# EAGLE design 02-ui (EAGLE 9.6.2)
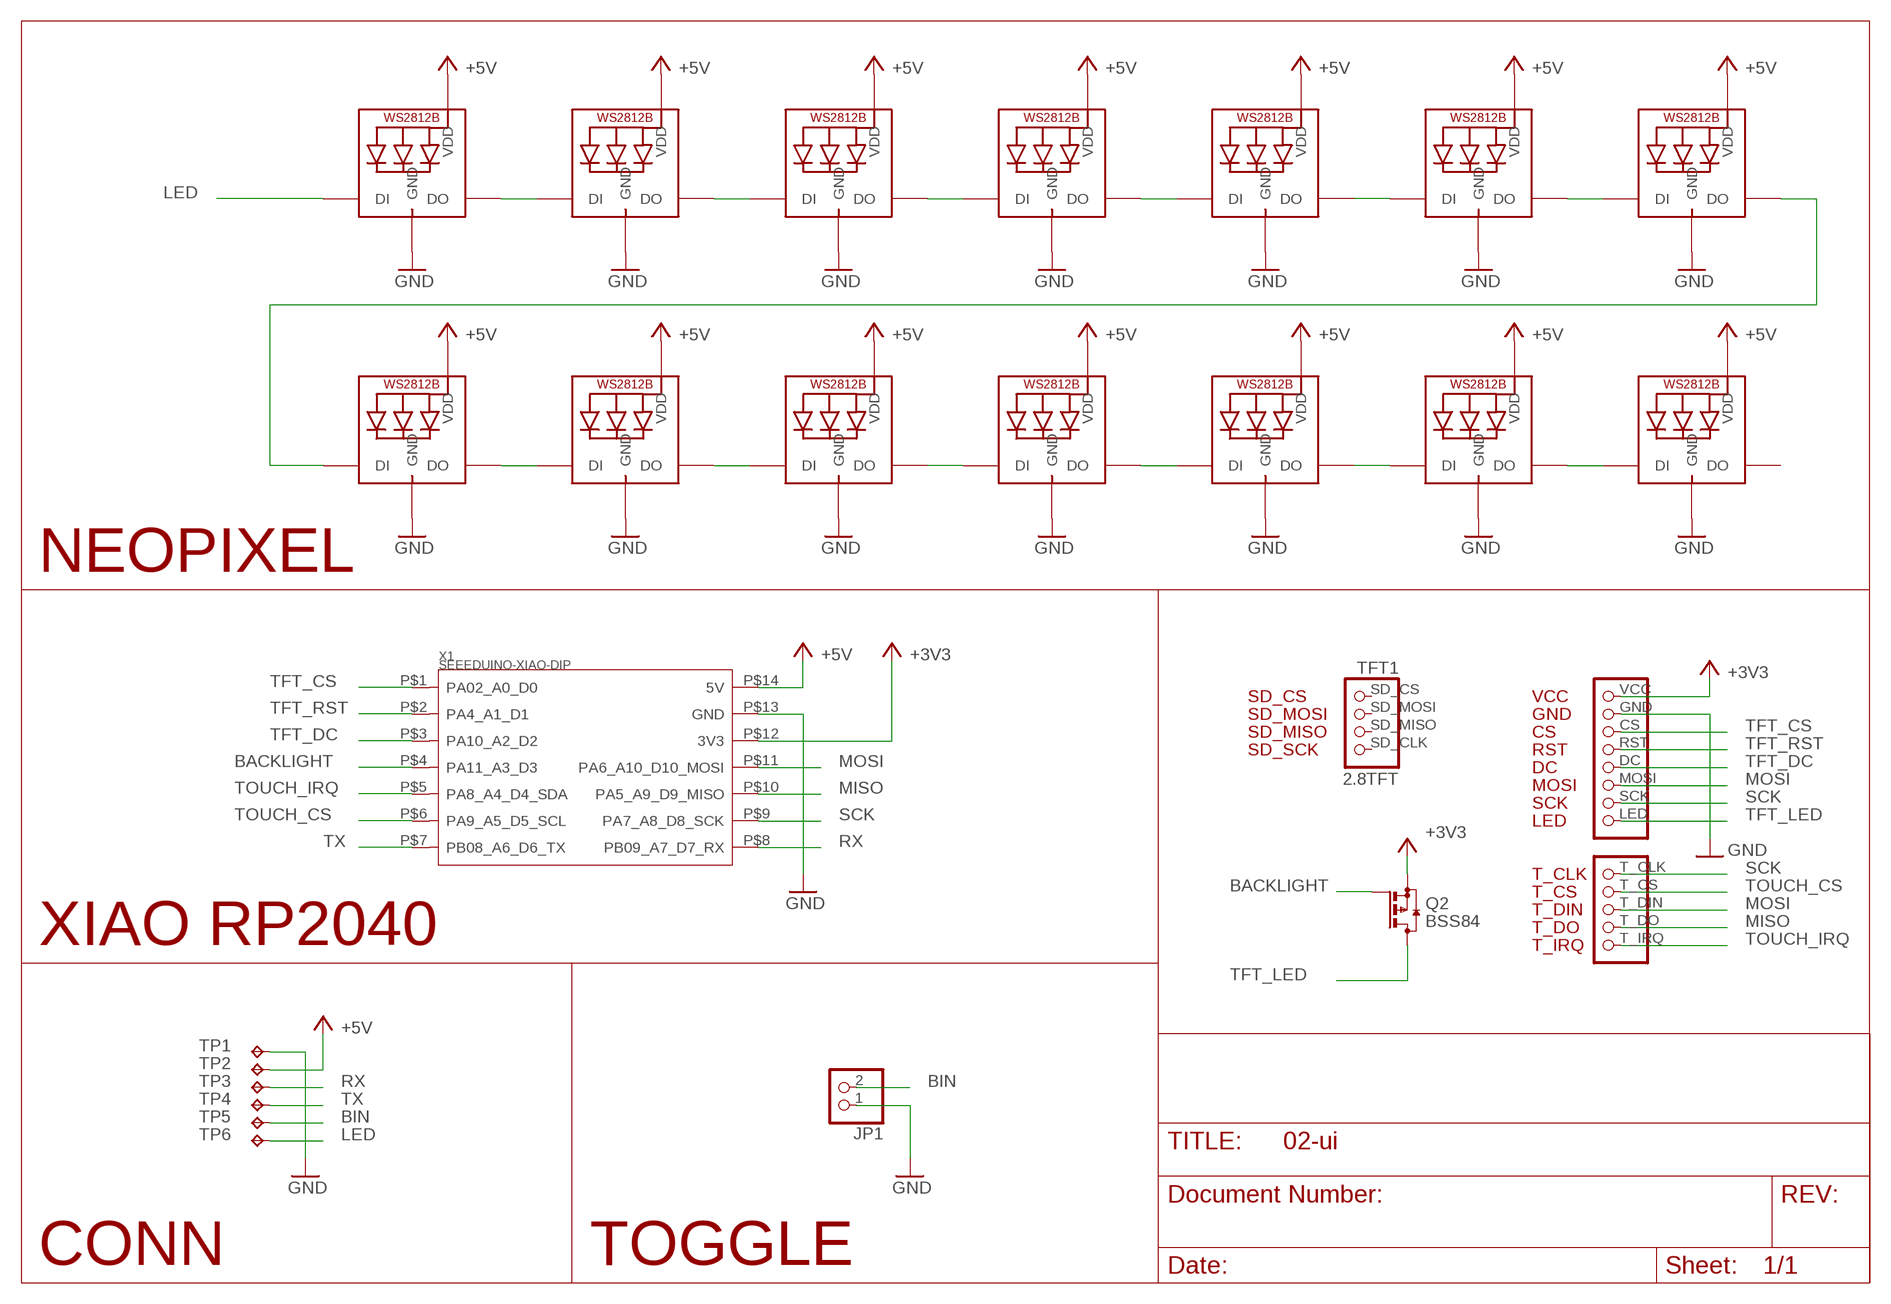
[diagram p0: schematic, sheet 1]

## Parts
JP1  PINHD-1X2  [1X02]
LED1  WS2812B_2020  [WS2812B_2020]
LED2  WS2812B_2020  [WS2812B_2020]
LED3  WS2812B_2020  [WS2812B_2020]
LED4  WS2812B_2020  [WS2812B_2020]
LED5  WS2812B_2020  [WS2812B_2020]
LED6  WS2812B_2020  [WS2812B_2020]
LED7  WS2812B_2020  [WS2812B_2020]
LED8  WS2812B_2020  [WS2812B_2020]
LED9  WS2812B_2020  [WS2812B_2020]
LED10  WS2812B_2020  [WS2812B_2020]
LED11  WS2812B_2020  [WS2812B_2020]
LED12  WS2812B_2020  [WS2812B_2020]
LED13  WS2812B_2020  [WS2812B_2020]
LED14  WS2812B_2020  [WS2812B_2020]
Q2  BSS84  [SOT23]
TFT1  2.8TFT  [2.8TFT]
TP1  TPTP10SQ  [TP10SQ]
TP2  TPTP10R  [TP10R]
TP3  TPTP10R  [TP10R]
TP4  TPTP10R  [TP10R]
TP5  TPTP10R  [TP10R]
TP6  TPTP10R  [TP10R]
X1  SEEEDUINO-XIAO-DIP  [XIAO-PINHEAD]

## Nets
+3V3: Q2.2(S) TFT1.VCC X1.P$12(3V3)
+5V: LED1.4(VDD) LED2.4(VDD) LED3.4(VDD) LED4.4(VDD) LED5.4(VDD) LED6.4(VDD) LED7.4(VDD) LED8.4(VDD) LED9.4(VDD) LED10.4(VDD) LED11.4(VDD) LED12.4(VDD) LED13.4(VDD) LED14.4(VDD) TP2.TP X1.P$14(5V)
BACKLIGHT: Q2.1(G) X1.P$4(PA11_A3_D3)
BIN: JP1.2 TP5.TP
GND: JP1.1 LED1.2(GND) LED2.2(GND) LED3.2(GND) LED4.2(GND) LED5.2(GND) LED6.2(GND) LED7.2(GND) LED8.2(GND) LED9.2(GND) LED10.2(GND) LED11.2(GND) LED12.2(GND) LED13.2(GND) LED14.2(GND) TFT1.GND TP1.TP X1.P$13(GND)
LED: LED1.3(DI) TP6.TP
MISO: TFT1.T_DO X1.P$10(PA5_A9_D9_MISO)
MOSI: TFT1.MOSI TFT1.T_DIN X1.P$11(PA6_A10_D10_MOSI)
N$1: LED1.1(DO) LED2.3(DI)
N$2: LED2.1(DO) LED3.3(DI)
N$3: LED3.1(DO) LED4.3(DI)
N$4: LED4.1(DO) LED5.3(DI)
N$5: LED6.1(DO) LED7.3(DI)
N$6: LED10.1(DO) LED11.3(DI)
N$7: LED8.1(DO) LED9.3(DI)
N$8: LED9.1(DO) LED10.3(DI)
N$9: LED5.1(DO) LED6.3(DI)
N$10: LED11.1(DO) LED12.3(DI)
N$11: LED12.1(DO) LED13.3(DI)
N$12: LED13.1(DO) LED14.3(DI)
N$13: LED7.1(DO) LED8.3(DI)
RX: TP3.TP X1.P$8(PB09_A7_D7_RX)
SCK: TFT1.SCK TFT1.T_CLK X1.P$9(PA7_A8_D8_SCK)
TFT_CS: TFT1.CS X1.P$1(PA02_A0_D0)
TFT_DC: TFT1.DC X1.P$3(PA10_A2_D2)
TFT_LED: Q2.3(D) TFT1.LED
TFT_RST: TFT1.RST X1.P$2(PA4_A1_D1)
TOUCH_CS: TFT1.T_CS X1.P$6(PA9_A5_D5_SCL)
TOUCH_IRQ: TFT1.T_IRQ X1.P$5(PA8_A4_D4_SDA)
TX: TP4.TP X1.P$7(PB08_A6_D6_TX)
Unconnected: LED14.1(DO) TFT1.SD_CLK(SD_SCK) TFT1.SD_CS TFT1.SD_MISO TFT1.SD_MOSI

## Notes on the sheet
- NEOPIXEL
- XIAO RP2040
- CONN | TOGGLE

## Library data of the parts
JP1 = pinhead-compact:PINHD-1X2: PIN HEADER
LED1-LED14 = microbuilder:WS2812B
Q2 = transistor-small-signal:BSS84: P-CHANNEL MOS FET
TFT1 = 2.8TFT:2.8TFT
TP1-TP6 = testpad:TP: Test pad
X1 = Seeeduino XIAO:SEEEDUINO-XIAO-DIP

## Net classes
0 default: width 0.254 mm

## Board
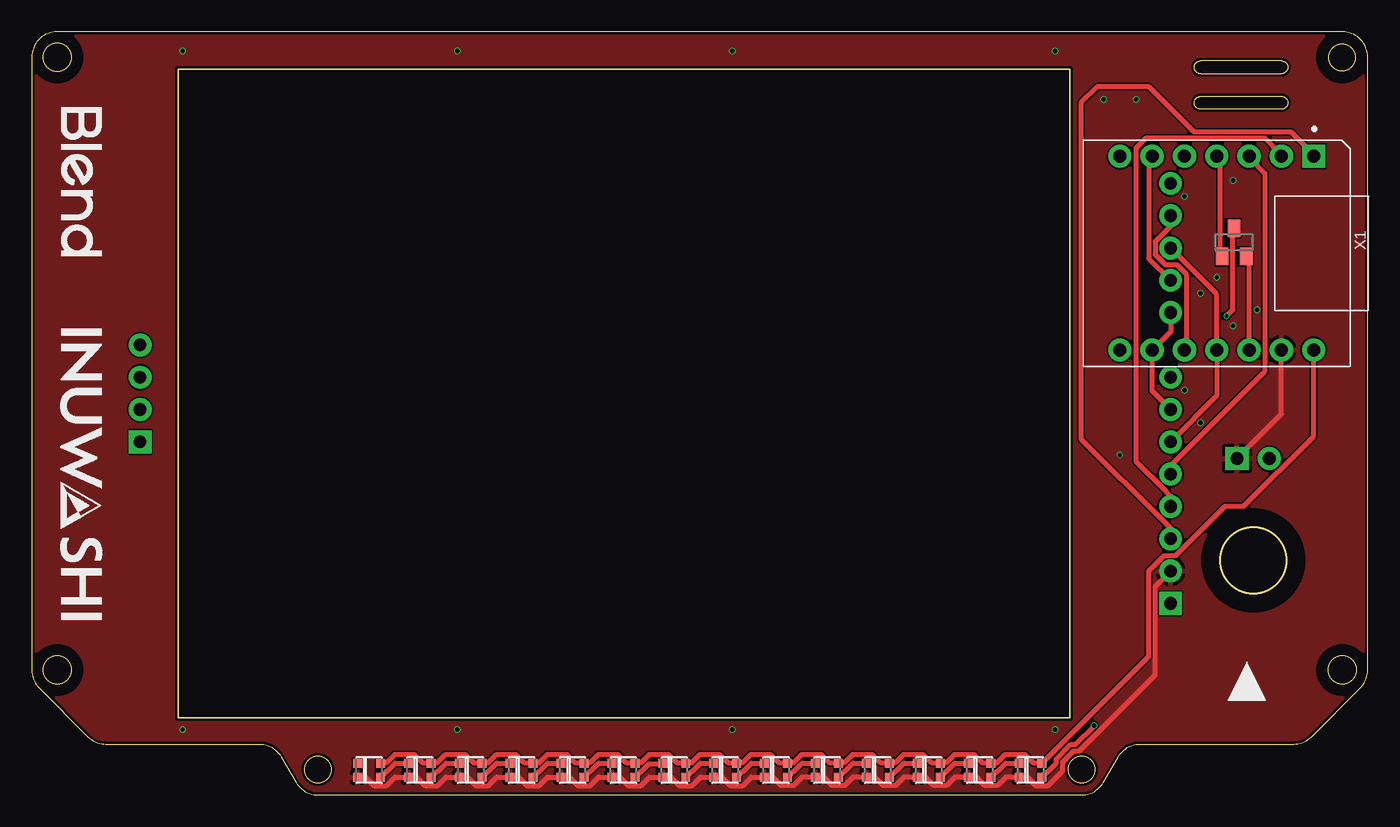
[diagram p1: board, top side]
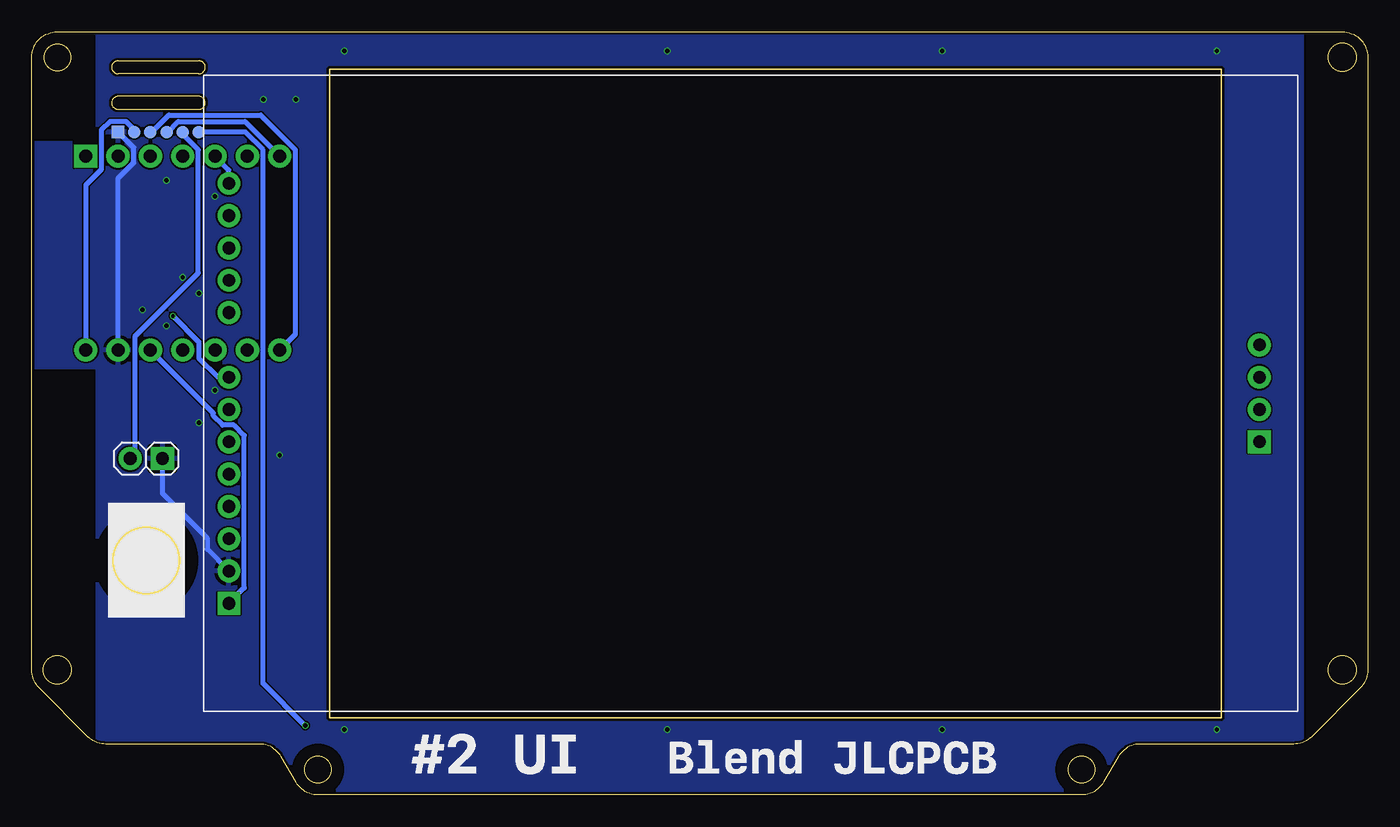
[diagram p2: board, bottom side, seen from below]

Size 105 x 60 mm. Coordinates in mm from the lower left corner, seen from the top.
Outline: 0.59,8.41 4.41,4.59 arc45 5.83,4 17.88,4 arc-60 19.61,3 20.77,1 arc60 22.5,0 82.5,0 arc60 84.23,1 85.39,3 arc-60 87.12,4 99.17,4 arc45 100.59,4.59 104.41,8.41 arc45 105,9.83 105,58 arc90 103,60 2,60 arc90 0,58 0,9.83 arc45 0.59,8.41
Outline: 98.22,53.91 91.87,53.91 arc-180 91.87,54.92 98.22,54.92 arc-180 98.22,53.91
Outline: 91.87,56.7 98.22,56.7 arc180 98.22,57.72 91.87,57.72 arc180 91.87,56.7
Outline: circle at 22.5,2 radius 1.05
Outline: circle at 82.5,2 radius 1.05
Outline: circle at 2,58 radius 1.1
Outline: circle at 2,9.83 radius 1.1
Outline: circle at 103,58 radius 1.05
Outline: circle at 103,9.83 radius 1.1
Outline: circle at 96,18.45 radius 2.6
Copper layers (1*16): Top 0.035mm / dielectric 1.6mm / Bottom 0.035mm
Design rules "jlcpcb-2layers *": minimum track width 5mil, minimum drill 0.3mm, track to track 5mil, track to pad 5mil, pad to pad 5mil, via to via 5mil, smd to smd 5mil, copper to edge 0.2mm, drill to drill 6mil, minimum pad ring 10mil, minimum via ring 3mil, stop-mask expansion 4mil, vias tented up to drill 15mil, thermal gap 10mil
tRestrict: area 0,56 to 4,60; area 0,7.8 to 4,11.8; area 101,56 to 105,60; area 101,7.8 to 105,11.8; area 92,14.4 to 100,22.4
bRestrict: area 101,56 to 105,60; area 101,7.8 to 105,11.8; area 20.5,0 to 24.5,4; area 80.5,0 to 84.5,4; area -0.5,3.5 to 5,60.4; area 92,14.4 to 100,22.4; area 0,56 to 4,60; area 0,7.8 to 4,11.8; area 100,51.4 to 105,59.9; area 100,3.9 to 105,33.4

### Footprints (pad centres in the part's own frame; a part is rotated, then mirrored left to right if it is on the bottom)
1X02 = drill 1.016 square: 1 -1.27,0 | drill 1.016: 2 1.27,0
WS2812B_2020 = smd 0.7 x 0.7: 1 0.9,-0.55; 2 0.9,0.55; 3 -0.9,0.55; 4 -0.9,-0.55
SOT23 = smd 1 x 1.4: 1 -0.95,-1.1; 2 0.95,-1.1; 3 0,1.1
2.8TFT = drill 1: CS 84,-36.43; DC 84,-31.35; GND 84,-38.97; LED 84,-23.73; MOSI 84,-28.81; RST 84,-33.89; SCK 84,-26.27; SD_CLK 3,-21.19; SD_MISO 3,-23.73; SD_MOSI 3,-26.27; T_CLK 84,-18.65; T_CS 84,-16.11; T_DIN 84,-13.57; T_DO 84,-11.03; T_IRQ 84,-8.49 | drill 1 square: SD_CS 3,-28.81; VCC 84,-41.51
TP10SQ = smd 1 x 1: TP 0,0
TP10R = smd 1 x 1: TP 0,0
XIAO-PINHEAD = drill 1.016 square: P$1 -7.62,7.62 | drill 1.016: P$2 -7.62,5.08; P$3 -7.62,2.54; P$4 -7.62,0; P$5 -7.62,-2.54; P$6 -7.62,-5.08; P$7 -7.62,-7.62; P$8 7.62,-7.62; P$9 7.62,-5.08; P$10 7.62,-2.54; P$11 7.62,0; P$12 7.62,2.54; P$13 7.62,5.08; P$14 7.62,7.62

### Placement (x,y rotation side)
JP1  96,26.45 180 bottom
LED1  78.5,1.95 180 top
LED2  74.5,1.95 180 top
LED3  70.5,1.95 180 top
LED4  66.5,1.95 180 top
LED5  62.5,1.95 180 top
LED6  58.5,1.95 180 top
LED7  54.5,1.95 180 top
LED8  50.5,1.95 180 top
LED9  46.5,1.95 180 top
LED10  42.5,1.95 180 top
LED11  38.5,1.95 180 top
LED12  34.5,1.95 180 top
LED13  30.5,1.95 180 top
LED14  26.5,1.95 180 top
Q2  94.5,43.45 0 top
TFT1  5.51,56.57 0 top
TP1  98.22,52.13 0 bottom
TP2  96.95,52.13 0 bottom
TP3  95.68,52.13 0 bottom
TP4  94.41,52.13 0 bottom
TP5  93.14,52.13 0 bottom
TP6  91.87,52.13 0 bottom
X1  93.14,42.6 270 top

### Tracks (layer width: path | path; a pad name or v marks a point on that pad's centre or on a via)
+3V3
  Top 0.381: X1.P$12 95.68,42.22 Q2.2
  Bottom 0.381: X1.P$12 90.73,30.03 90.73,29.8 90.01,29.09 89.11,29.09 88.29,28.27 88.29,16.31 | 88.29,16.28 88.29,16.31 | TFT1.VCC 89.33,15.3 88.31,16.31 88.29,16.31
+5V
  Top 0.381: LED14.4 27.83,2.5 28.5,3.17 30.08,3.17 30.75,2.5 LED13.4 31.83,2.5 32.5,3.17 34.08,3.17 34.75,2.5 LED12.4 35.83,2.5 36.5,3.17 38.08,3.17 38.75,2.5 LED11.4 39.83,2.5 40.5,3.17 42.08,3.17 42.75,2.5 LED10.4 43.83,2.5 44.5,3.17 46.08,3.17 46.75,2.5 LED9.4 47.83,2.5 48.5,3.17 50.08,3.17 50.75,2.5 LED8.4 51.83,2.5 52.5,3.17 54.08,3.17 54.75,2.5 LED7.4 55.83,2.5 56.5,3.17 58.08,3.17 58.75,2.5 LED6.4 59.83,2.5 60.5,3.17 62.08,3.17 62.75,2.5 LED5.4 63.83,2.5 64.5,3.17 66.08,3.17 66.75,2.5 LED4.4 67.83,2.5 68.5,3.17 70.08,3.17 70.75,2.5 LED3.4 71.83,2.5 72.5,3.17 74.08,3.17 74.75,2.5 LED2.4 75.83,2.5 76.5,3.17 78.08,3.17 78.75,2.5 LED1.4 87.78,10.88 87.78,17.6 89.01,18.82 89.91,18.82 93.8,22.71 95.28,22.71 100.76,28.2 X1.P$14
  Bottom 0.381: X1.P$14 100.76,47.94 99.53,49.18 99.53,52.27 98.85,52.94 97.59,52.94 96.95,52.31 TP2.TP
BACKLIGHT
  Top 0.381: Q2.1 93.39,42.48 93.39,49.84 93.14,50.1 X1.P$4
BIN
  Bottom 0.381: JP1.2 96.91,26.81 96.91,36.04 91.91,41.04 91.91,50.73 93.14,51.96 TP5.TP
GND  (via drill 0.35)
  Top 0.381: LED14.2 26.25,1.4 26.92,0.73 27.88,0.73 28.55,1.4 LED13.2 30.25,1.4 30.92,0.73 31.88,0.73 32.55,1.4 LED12.2 34.25,1.4 34.92,0.73 35.88,0.73 36.55,1.4 LED11.2 38.25,1.4 38.92,0.73 39.88,0.73 40.55,1.4 LED10.2 42.25,1.4 42.92,0.73 43.88,0.73 44.55,1.4 LED9.2 46.25,1.4 46.92,0.73 47.88,0.73 48.55,1.4 LED8.2 50.25,1.4 50.92,0.73 51.88,0.73 52.55,1.4 LED7.2 54.25,1.4 54.92,0.73 55.88,0.73 56.55,1.4 LED6.2 58.25,1.4 58.92,0.73 59.88,0.73 60.55,1.4 LED5.2 62.25,1.4 62.92,0.73 63.88,0.73 64.55,1.4 LED4.2 66.25,1.4 66.92,0.73 67.88,0.73 68.55,1.4 LED3.2 70.25,1.4 70.92,0.73 71.88,0.73 72.55,1.4 LED2.2 74.25,1.4 74.92,0.73 75.88,0.73 76.55,1.4 LED1.2 78.25,1.4 78.92,0.73 79.88,0.73 81.03,1.88 81.03,2.61 81.89,3.47 82.32,3.47 88.29,9.44 88.29,16.39 TFT1.GND | JP1.1 98.22,29.94 X1.P$13
  Bottom 0.381: X1.P$13 98.22,48.48 96.99,49.71 96.99,50.9 TP1.TP | JP1.1 94.73,23.71 91.23,20.21 91.23,19.33 TFT1.GND
  other vias: 80.44,5.14 80.44,58.48 11.86,58.48 33.45,58.48 55.04,58.48 11.86,5.14 55.04,5.14 33.45,5.14 85.52,26.73 84.25,54.67 86.79,54.67 90.6,31.81 91.87,39.43 90.6,47.05 93.14,40.7 94.41,48.32 96.31,38.16 94.41,36.89 91.87,29.27
  pour Bottom: -0.84,61.02 -0.84,-1.21 98.22,-1.21 105.84,-1.21 105.84,61.02
  pour Top: -0.84,61.02 -0.84,-1.21 105.84,-1.21 105.84,61.02
LED  (via drill 0.35)
  Top 0.381: LED1.3 79.83,1.83 79.88,1.83 80.53,2.47 80.53,2.82 81.68,3.97 82.03,3.97 v83.5,5.45
  Bottom 0.381: TP6.TP 88.22,52.13 86.83,50.73 86.83,8.78 v83.5,5.45
MISO
  Top 0.381: X1.P$10 90.73,35.11 90.73,40.97 90.01,41.68 89.11,41.68 88.29,42.5 88.29,43.51 89.51,44.72 TFT1.T_DO
MOSI
  Top 0.381: TFT1.MOSI 93.14,31.39 X1.P$11 93.14,39.37 TFT1.T_DIN
N$1
  Top 0.381: LED2.3 75.83,1.83 75.88,1.83 76.55,2.5 LED1.1
N$2
  Top 0.381: LED3.3 71.83,1.83 71.88,1.83 72.55,2.5 LED2.1
N$3
  Top 0.381: LED4.3 67.83,1.83 67.88,1.83 68.55,2.5 LED3.1
N$4
  Top 0.381: LED5.3 63.83,1.83 63.88,1.83 64.55,2.5 LED4.1
N$5
  Top 0.381: LED7.3 55.83,1.83 55.88,1.83 56.55,2.5 LED6.1
N$6
  Top 0.381: LED11.3 39.83,1.83 39.88,1.83 40.55,2.5 LED10.1
N$7
  Top 0.381: LED9.3 47.83,1.83 47.88,1.83 48.5,2.45 49.55,2.45 LED8.1
N$8
  Top 0.381: LED10.3 43.83,1.83 43.88,1.83 44.55,2.5 LED9.1
N$9
  Top 0.381: LED6.3 59.83,1.83 59.88,1.83 60.55,2.5 LED5.1
N$10
  Top 0.381: LED12.3 35.83,1.83 35.88,1.83 36.55,2.5 LED11.1
N$11
  Top 0.381: LED13.3 31.83,1.83 31.88,1.83 32.55,2.5 LED12.1
N$12
  Top 0.381: LED14.3 27.83,1.83 27.88,1.83 28.55,2.5 LED13.1
N$13
  Top 0.381: LED8.3 51.83,1.83 51.88,1.83 52.55,2.5 LED7.1
RX
  Bottom 0.381: TP3.TP 95.57,52.13 94.24,53.45 87.01,53.45 84.29,50.73 84.29,36.21 X1.P$8
SCK
  Top 0.381: TFT1.T_CLK 89.51,36.43 X1.P$9 88.06,31.75 TFT1.SCK
TFT_CS
  Top 0.381: X1.P$1 100.76,50.35 98.98,52.13 91.36,52.13 87.81,55.68 83.74,55.68 82.47,54.41 82.47,28 89.08,21.39 89.33,21.14 89.51,20.96 TFT1.CS
TFT_DC
  Top 0.381: X1.P$3 95.68,50.1 96.95,48.83 96.95,33.33 89.51,25.89 TFT1.DC
TFT_LED  (via drill 0.3)
  Top 0.381: v93.9,37.65 94.41,38.16 94.41,44.51 Q2.3
  Bottom 0.381: v93.9,37.65 91.87,35.62 91.87,34.35 90.37,32.84 TFT1.LED
TFT_RST
  Top 0.381: X1.P$2 98.22,50.35 96.95,51.62 87.55,51.62 86.79,50.86 86.79,26.22 89.08,23.93 89.33,23.68 89.51,23.5 TFT1.RST
TOUCH_CS
  Top 0.381: X1.P$6 87.78,49.95 87.78,42.19 TFT1.T_CS
TOUCH_IRQ
  Bottom 0.381: TFT1.T_IRQ 89.51,49.13 X1.P$5
TX
  Bottom 0.381: TP4.TP 94.3,52.13 93.48,52.94 88.24,52.94 X1.P$7